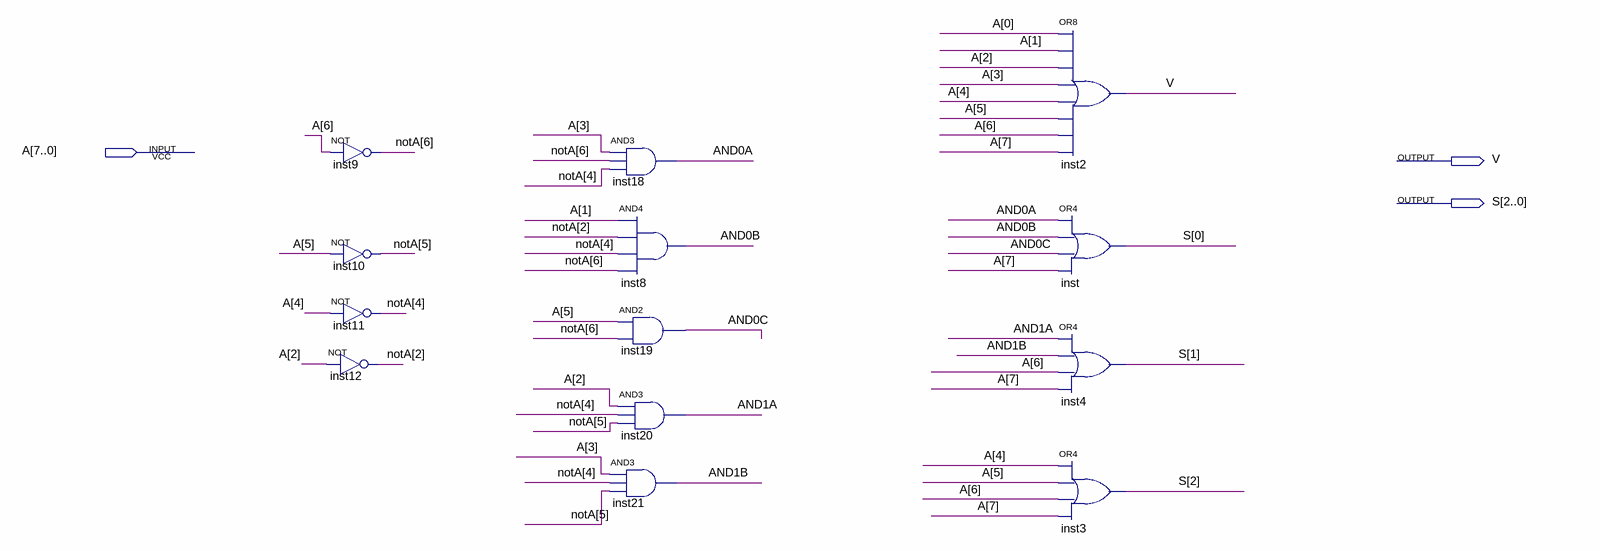
[diagram p0: schematic sheet]
// Quartus schematic Pencoder.bdf as structural Verilog: 13 symbols, 3 pins
module Pencoder (
  input  [7:0] A,
  output V,
  output [2:0] S
);

  wire AND0A, AND0B, AND0C, AND1A, AND1B;
  wire [6:2] notA;

  not inst9 (notA[6], A[6]);
  not inst10 (notA[5], A[5]);
  not inst11 (notA[4], A[4]);
  not inst12 (notA[2], A[2]);
  and inst18 (AND0A, A[3], notA[6], notA[4]);
  and inst8 (AND0B, A[1], notA[2], notA[4], notA[6]);
  and inst19 (AND0C, A[5], notA[6]);
  and inst20 (AND1A, A[2], notA[4], notA[5]);
  and inst21 (AND1B, A[3], notA[4], notA[5]);
  or inst2 (V, A[0], A[1], A[2], A[3], A[4], A[5], A[6], A[7]);
  or inst (S[0], AND0A, AND0B, AND0C, A[7]);
  or inst4 (S[1], AND1A, AND1B, A[6], A[7]);
  or inst3 (S[2], A[4], A[5], A[6], A[7]);
endmodule
